# Altium schematic sheet Output.SchDoc
size A4
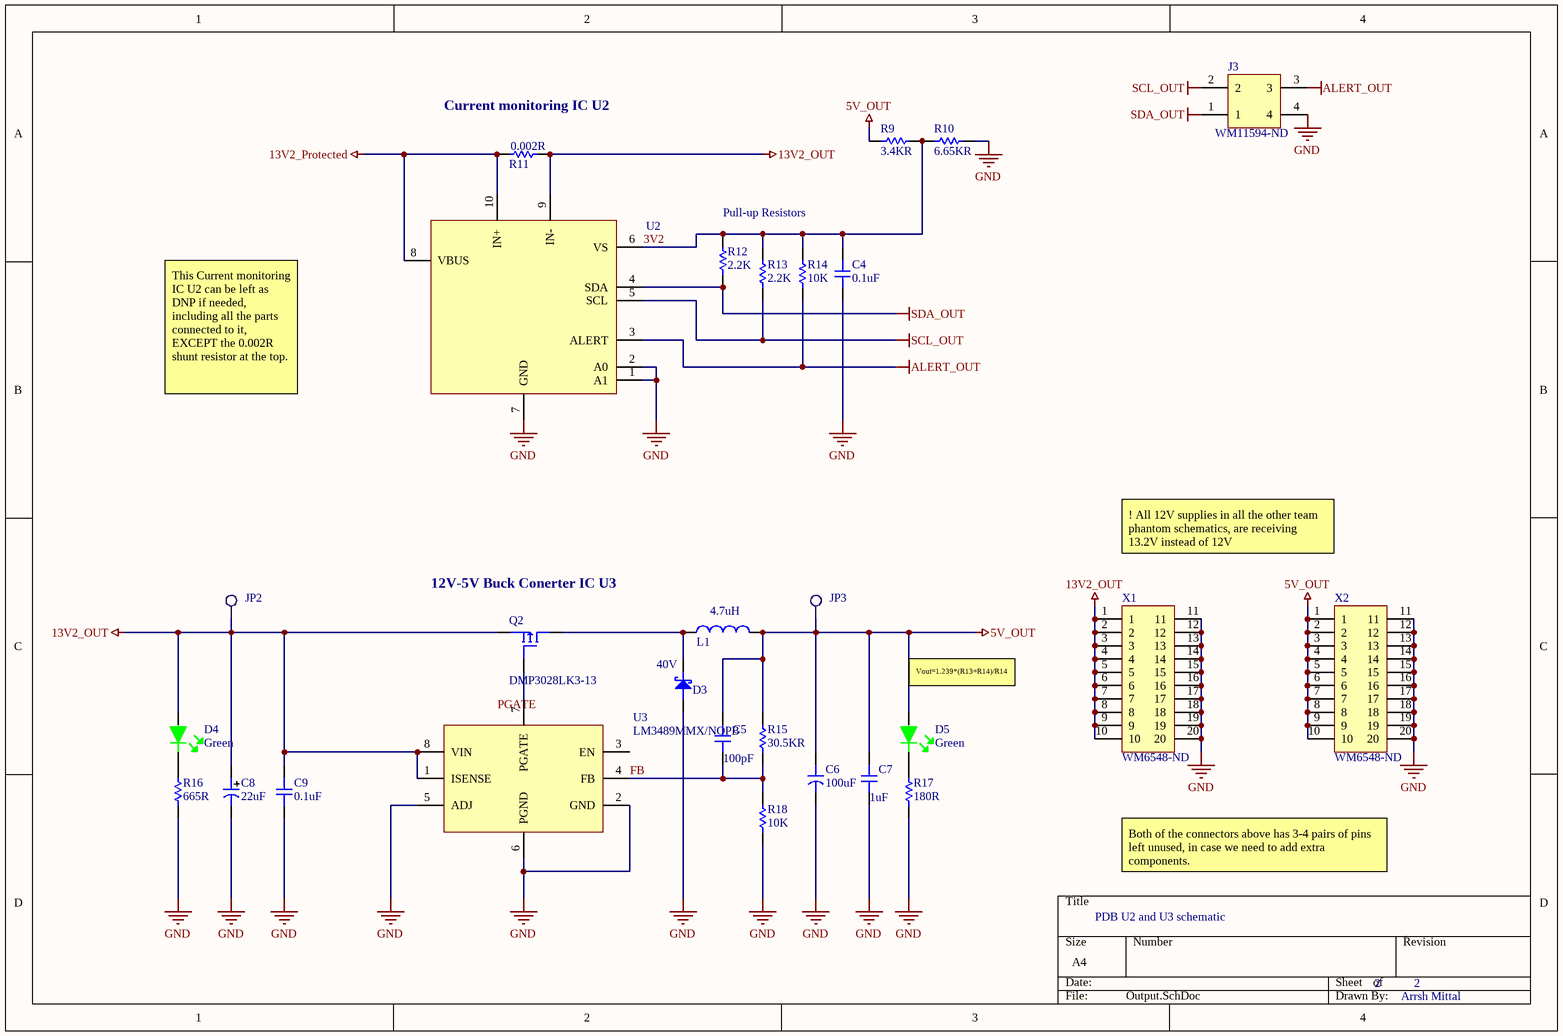
[diagram p0: Output.SchDoc]

## Parts
C4  0.1uF  [CAP-0805]
C5  100pF
C6  100uF  [CAP-1411]
C7  1uF  [CAP-0603]
C8  22uF
C9  0.1uF  [CAP-0805]
D3  40V
D4  Green  [LED-0603]
D5  Green  [LED-0603]
J3  WM11594-ND  [2X2PIN]
JP2  Testpoint2  [TP2]  (value not drawn)
JP3  Testpoint2  [TP2]  (value not drawn)
L1  4.7uH
Q2  DMP3028LK3-13  [DPAK228P990X239-4N]
R9  3.4KR  [RESC1608X50N]
R10  6.65KR  [RESC1608X50N]
R11  0.002R  [2512]
R12  2.2K  [RES-0603]
R13  2.2K  [RES-0603]
R14  10K  [RES-0603]
R15  30.5KR
R16  665R  [RES-0603]
R17  180R  [RES-0603]
R18  10K  [RES-0402]
U2  INA226AIDGSR  [SOP50P490X110-10N]  (value not drawn)
U3  LM3489MMX/NOPB  [SOP65P490X110-8N]
X1  WM6548-ND  [MOLEX_20pin(RECT)]
X2  WM6548-ND  [MOLEX_20pin(RECT)]

## Nets
5V_OUT: C5.2 C6.2 C7.2 D5.1 JP3.1 L1.2 R9.1 R15.2 X2.1 X2.2 X2.3 X2.4 X2.5 X2.6 X2.7 X2.8 X2.9 X2.10
13V2_OUT: C8.1 C9.2 D4.1 JP2.1 Q2.3 R11.1 U2.9(IN-) U3.1(ISENSE) U3.8(VIN) X1.1 X1.2 X1.3 X1.4 X1.5 X1.6 X1.7 X1.8 X1.9 X1.10
13V2_Protected: R11.2 U2.8(VBUS) U2.10(IN+)
ALERT_OUT: J3.3 R14.1 U2.3(ALERT)
GND: C4.1 C6.1 C7.1 C8.2 C9.1 D3.2 J3.4 R10.2 R16.1 R17.1 R18.1 U2.1(A1) U2.2(A0) U2.7(GND) U3.2(GND) U3.5(ADJ) U3.6(PGND) X1.11 X1.12 X1.13 X1.14 X1.15 X1.16 X1.17 X1.18 X1.19 X1.20 X2.11 X2.12 X2.13 X2.14 X2.15 X2.16 X2.17 X2.18 X2.19 X2.20
SCL_OUT: J3.2 R13.1 U2.5(SCL)
SDA_OUT: J3.1 R12.1 U2.4(SDA)
3V2: C4.2 R9.2 R10.1 R12.2 R13.2 R14.2 U2.6(VS)
FB: C5.1 R15.1 R18.2 U3.4(FB)
NetD3_1: D3.1 L1.1 Q2.2
NetD4_2: D4.2 R16.2
NetD5_2: D5.2 R17.2
NetQ2_1: Q2.1 U3.7(PGATE)

Not connected (* = marked no-connect by the designer): U3 3(EN)

## Notes on the sheet
- (near R11) Current monitoring IC U2
- Pull-up Resistors
- This Current monitoring IC U2 can be left as DNP if needed, including all the parts connected to it, EXCEPT the 0.002R shunt resistor at the top.
- ! All 12V supplies in all the other team phantom schematics, are receiving 13.2V instead of 12V
- (near Q2) 12V-5V Buck Conerter IC U3
- (near D5) Vout=1.239*(R13+R14)/R14
- PDB U2 and U3 schematic
- Both of the connectors above has 3-4 pairs of pins left unused, in case we need to add extra components.
- 2
- Arrsh Mittal

## Library data of the parts
C4 = 0805-0.1uF-16V: CAP CER 0.1UF 16V Y5V 0805; Manufacturer: KEMET; Manufacturer Part Number: C0805C104Z4VACTU; Dielectric Material: Ceramic; Capacitance: 100nF; Tolerance: 80%; Supplier 1: Digi-Key; Stock 1: 18565; Pricing 1: 1=0.11, 10=0.081, 100=0.038, 500=0.02664, 1000=0.02205 (USD); Mount: Surface Mount; Case/Package: 0805; Case Code (Metric): 2012; Case Code (Imperial): 0805; Min Operating Temperature: -30°C; Max Operating Temperature: 85°C; Package Quantity: 1; Voltage Rating: 16V; Packaging: Tape and Reel; Voltage Rating (DC): 16V; Dielectric: Y5V; Termination: SMD/SMT; Length: 2mm; Height: 0.78mm; Width: 0.049inch; Thickness: 0.035inch; Lead Pitch: 0.75mm; Depth: 1.25mm; Lead Free: Lead Free; ComponentLink1URL: https://search.kemet.com/component-edge/download/datasheet/C0805C104Z4VACTU.pdf?src-supplier=Digi-Key; ComponentLink1Description: https://search.kemet.com/component-edge/download/datasheet/C0805C104Z4VACTU.pdf?src-supplier=Digi-Key; ComponentLink2URL: https://api.kemet.com/component-edge/download/datasheet/C0805C104Z4VACTU.pdf?src-supplier=Digi-Key; ComponentLink2Description: https://api.kemet.com/component-edge/download/datasheet/C0805C104Z4VACTU.pdf?src-supplier=Digi-Key; ComponentLink3URL: http://www.mouser.com/ds/2/212/KEM_C1005_Y5V_SMD-1101305.pdf?src-supplier=Mouser; ComponentLink3Description: http://www.mouser.com/ds/2/212/KEM_C1005_Y5V_SMD-1101305.pdf?src-supplier=Mouser; ComponentLink4URL: http://components.arrow.com/part/dataview/2091119S8993596N7429?src-supplier=Arrow; ComponentLink4Description: http://components.arrow.com/part/dataview/2091119S8993596N7429?src-supplier=Arrow; Supplier Part Number 1: 399-9159-6-ND
C5 = 0603-100pF-50V: 0603 100 pF 50 V ±5% Tolerance C0G/NP0 SMT Multilayer Ceramic Capacitor; Manufacturer: Kyocera AVX; Manufacturer Part Number: 06035A101JAT2A\4K; Supplier 1: Digi-Key; Stock 1: 87306; Pricing 1: 1=0.1, 10=0.074, 50=0.0402, 100=0.0329, 500=0.02348, 1000=0.01845 (USD); Supplier Part Number 1: 478-1175-6-ND
C6 = 1411-100uF-6.3V: CAP TANT 100UF 10% 6.3V 1411; Manufacturer: KEMET; Manufacturer Part Number: T495B107K006ATE400; ESR (Equivalent Series Resistance): 400mR; Polarity: Polar; Life (Hours): 2000Hour; Dissipation Factor: 15%; Supplier 1: Digi-Key; Stock 1: 3565; Pricing 1: 1=1.82, 10=1.471, 100=1.123, 500=0.8556, 1000=0.74865 (USD); Mount: Surface Mount; Case/Package: 1411; Weight: 0.002293oz; Case Code (Metric): 3528; Case Code (Imperial): 1411; Min Operating Temperature: -55°C; Max Operating Temperature: 125°C; Package Quantity: 1; Capacitance: 100uF; Voltage Rating: 6.3V; Tolerance: 10%; Packaging: Tape and Reel; Voltage Rating (DC): 6.3V; Termination: SMD/SMT; Features: General Purpose; Length: 3.5mm; Height: 2.8mm; Width: 0.11inch; Height - Seated (Max): 0.083inch; Depth: 2.8mm; Radiation Hardening: No; REACH SVHC: No SVHC; ComponentLink1URL: https://search.kemet.com/component-edge/download/datasheet/T495B107K006ATE400.pdf?src-supplier=Digi-Key; ComponentLink1Description: https://search.kemet.com/component-edge/download/datasheet/T495B107K006ATE400.pdf?src-supplier=Digi-Key; ComponentLink2URL: http://www.farnell.com/datasheets/2015696.pdf?src-supplier=Element14; ComponentLink2Description: http://www.farnell.com/datasheets/2015696.pdf?src-supplier=Element14; ComponentLink3URL: http://www.farnell.com/datasheets/2015696.pdf?src-supplier=Farnell; ComponentLink3Description: http://www.farnell.com/datasheets/2015696.pdf?src-supplier=Farnell; ComponentLink4URL: http://components.arrow.com/part/dataview/43511620S9336597N7429?src-supplier=Arrow; ComponentLink4Description: http://components.arrow.com/part/dataview/43511620S9336597N7429?src-supplier=Arrow; ComponentLink5URL: http://components.arrow.com/part/dataview/0323_00067285?src-supplier=Arrow+Europe; ComponentLink5Description: http://components.arrow.com/part/dataview/0323_00067285?src-supplier=Arrow+Europe; ComponentLink6URL: http://www.mouser.com/ds/2/212/KEM_T2071_T495_COTS-1104607.pdf?src-supplier=Mouser; ComponentLink6Description: http://www.mouser.com/ds/2/212/KEM_T2071_T495_COTS-1104607.pdf?src-supplier=Mouser; ComponentLink7URL: http://www.kemet.com/Lists/ProductCatalog/Attachments/261/KEM_T2009_T495.pdf?src-supplier=Avnet; ComponentLink7Description: http://www.kemet.com/Lists/ProductCatalog/Attachments/261/KEM_T2009_T495.pdf?src-supplier=Avnet; Supplier Part Number 1: 399-10286-6-ND
C7 = 0603-1uF-16V: CAP CER 1UF 16V X7R 0603; Manufacturer: KEMET; Manufacturer Part Number: C0603C105K4RACTU; Dielectric Material: Ceramic; Tolerance: 10%; Dissipation Factor: 3.5%; Supplier 1: Digi-Key; Stock 1: 600463; Pricing 1: 1=0.12, 10=0.088, 100=0.0391, 500=0.02792, 1000=0.02193 (USD); Mount: Surface Mount,PCB; Case/Package: 0603; Number of Pins: 2; Case Code (Metric): 1608; Case Code (Imperial): 0603; Contact Plating: Tin,Matte; Min Operating Temperature: -55°C; Max Operating Temperature: 125°C; Package Quantity: 4000; Capacitance: 1uF; Voltage Rating: 16V; Packaging: Tape and Reel; Voltage Rating (DC): 16V; Dielectric: X7R; Termination: SMD/SMT; Voltage: 16V; Length: 1.6mm; Height: 0.8mm; Width: 0.031inch; Thickness: 0.034inch; Depth: 0.8mm; Radiation Hardening: No; REACH SVHC: No SVHC; ComponentLink1URL: http://www.mouser.com/ds/2/212/KEM_C1002_X7R_SMD-1102033.pdf?src-supplier=Mouser; ComponentLink1Description: http://www.mouser.com/ds/2/212/KEM_C1002_X7R_SMD-1102033.pdf?src-supplier=Mouser; ComponentLink2URL: http://www.kemet.com/kemet/web/homepage/kechome.nsf/file/Commercial%20Ceramic%20Chips%20X7R%20Dielectric/$file/KEM_C1002_X7R_SMD.pdf?src-supplier=Element14; ComponentLink2Description: http://www.kemet.com/kemet/web/homepage/kechome.nsf/file/Commercial%20Ceramic%20Chips%20X7R%20Dielectric/$file/KEM_C1002_X7R_SMD.pdf?src-supplier=Element14; ComponentLink3URL: https://www.verical.com/server-webapp/html/getDatasheet?partID=385479&src-supplier=Verical; ComponentLink3Description: https://www.verical.com/server-webapp/html/getDatasheet?partID=385479&src-supplier=Verical; ComponentLink4URL: http://www.kemet.com/kemet/web/homepage/kechome.nsf/vapubfiles/KEM_C1002_X7R_SMD.pdf/$file/KEM_C1002_X7R_SMD.pdf?src-supplier=Element14; ComponentLink4Description: http://www.kemet.com/kemet/web/homepage/kechome.nsf/vapubfiles/KEM_C1002_X7R_SMD.pdf/$file/KEM_C1002_X7R_SMD.pdf?src-supplier=Element14; Supplier Part Number 1: 399-7847-6-ND
C8 = AEC-22uF-50V: Aluminum Electrolytic Capacitors - SMD 22uF 50 Volts 20% LYTICS/IC; Manufacturer: CDE Illinois Capacitor; Manufacturer Part Number: 226SML050M; Voltage Rating: 50V; ESR (Equivalent Series Resistance): 9.043R; Polarity: Polar; Ripple Current: 71mA; Life (Hours): 2000Hour; Supplier 1: Digi-Key; Stock 1: 2681; Pricing 1: 1=0.36, 10=0.248, 50=0.1732, 100=0.1485, 500=0.11138 (USD); Mount: Surface Mount; Case/Package: Radial; Min Operating Temperature: -40°C; Max Operating Temperature: 85°C; Capacitance: 22uF; Package Quantity: 1000; Packaging: Tape and Reel; Tolerance: 20%; Voltage Rating (DC): 50V; Diameter: 6.3mm; Length: 5.8mm; Height - Seated (Max): 0.217inch; Lead Free: Lead Free; ComponentLink1URL: http://www.illinoiscapacitor.com/pdf/seriesDocuments/SML%20series.pdf?src-supplier=Future+Electronics; ComponentLink1Description: http://www.illinoiscapacitor.com/pdf/seriesDocuments/SML%20series.pdf?src-supplier=Future+Electronics; Supplier Part Number 1: 1572-1392-6-ND
C9 = 0805-0.1uF-50V: CAP CER 0.1UF 50V Y5V 0805; Manufacturer: KEMET; Manufacturer Part Number: C0805C104Z5VACTU; Dielectric Material: Ceramic; Capacitance: 100nF; Tolerance: 80%; Dissipation Factor: 5%; Supplier 1: Digi-Key; Stock 1: 929243; Pricing 1: 1=0.1, 10=0.057, 100=0.0254, 500=0.01818, 1000=0.01428 (USD); Mount: Surface Mount,PCB; Case/Package: 0805; Number of Pins: 2; Case Code (Metric): 2012; Case Code (Imperial): 0805; Min Operating Temperature: -30°C; Max Operating Temperature: 85°C; Package Quantity: 1; Voltage Rating: 50V; Packaging: Tape and Reel; Voltage Rating (DC): 50V; Dielectric: Y5V; Termination: SMD/SMT; Voltage: 50V; Length: 2mm; Height: 0.9mm; Lead Pitch: 0.75mm; Width: 0.049inch; Thickness: 0.039inch; Depth: 1.25mm; Radiation Hardening: No; REACH SVHC: No SVHC; Lead Free: Lead Free; ComponentLink1URL: http://www.alliedelec.com/m/d/9bfe7773041ffe9d406e68bc7b377fdd.pdf?src-supplier=Allied+Electronics; ComponentLink1Description: http://www.alliedelec.com/m/d/9bfe7773041ffe9d406e68bc7b377fdd.pdf?src-supplier=Allied+Electronics; ComponentLink2URL: https://www.verical.com/server-webapp/html/getDatasheet?partID=37101&src-supplier=Verical; ComponentLink2Description: https://www.verical.com/server-webapp/html/getDatasheet?partID=37101&src-supplier=Verical; ComponentLink3URL: https://www.verical.com/server-webapp/html/getDatasheet?partID=321176&src-supplier=Verical; ComponentLink3Description: https://www.verical.com/server-webapp/html/getDatasheet?partID=321176&src-supplier=Verical; ComponentLink4URL: http://www.farnell.com/datasheets/2123124.pdf?src-supplier=Element14; ComponentLink4Description: http://www.farnell.com/datasheets/2123124.pdf?src-supplier=Element14; Supplier Part Number 1: 399-1177-6-ND
D3 = Schottky-40V-8A: DIODE SCHOTTKY 40V 8A DO214AB; Manufacturer: MCC; Manufacturer Part Number: SK84L-TP; Forward Voltage: 650mV; Max Reverse Current: 20mA; Max Forward Surge Current (Ifsm): 200A; Supplier 1: Digi-Key; Stock 1: 7713; Pricing 1: 1=0.72, 10=0.62, 100=0.4293, 500=0.3587, 1000=0.30528 (USD); Mount: Surface Mount; Number of Pins: 2; Min Operating Temperature: -55°C; Max Operating Temperature: 150°C; Packaging: Tape and Reel; Package Quantity: 1; Average Rectified Current: 8A; Forward Current: 8A; Max Repetitive Reverse Voltage (Vrrm): 40V; Max Reverse Voltage (DC): 40V; Series: SK84L; Lead Free: Lead Free; RoHS Compliant: Yes; ComponentLink1URL: http://www.mccsemi.com/up_pdf/SK82L-SK810L(SMC).PDF?src-supplier=Future+Electronics; ComponentLink1Description: http://www.mccsemi.com/up_pdf/SK82L-SK810L(SMC).PDF?src-supplier=Future+Electronics; ComponentLink2URL: http://www.mccsemi.com/up_pdf/SK82L-SK810L(SMC).PDF?src-supplier=Digi-Key; ComponentLink2Description: http://www.mccsemi.com/up_pdf/SK82L-SK810L(SMC).PDF?src-supplier=Digi-Key; Supplier Part Number 1: SK84L-TPMSDKR-ND
D4 D5 = LED-Green: LED GREEN CLEAR 0603 SMD; Manufacturer: Wurth Electronics; Manufacturer Part Number: 150060VS75000; Luminous Intensity: 40mcd; Viewing Angle: 140°; Forward Voltage: 2V; Wavelength: 570nm; Lens Style: Clear,Rectangular; Forward Current: 30mA; Test Current: 20mA; Supplier 1: Digi-Key; Stock 1: 118118; Pricing 1: 1=0.14, 50=0.133, 100=0.114, 500=0.099 (USD); Mount: Surface Mount; Case/Package: 0603; Number of Pins: 2; Color: Green; Case Code (Metric): 1608; Case Code (Imperial): 0603; Min Operating Temperature: -40°C; Max Operating Temperature: 85°C; Package Quantity: 1; Packaging: Tape and Reel; Dominant Wavelength: 570nm; Length: 1.6mm; Height: 0.7mm; Width: 0.8mm; REACH SVHC: Unknown; ComponentLink1URL: https://katalog.we-online.de/led/datasheet/150060VS75000.pdf?src-supplier=Digi-Key; ComponentLink1Description: https://katalog.we-online.de/led/datasheet/150060VS75000.pdf?src-supplier=Digi-Key; Supplier Part Number 1: 732-4980-1-ND
J3 = 2X2PIN: CONN HEADER R/A 4POS 3.5MM; Manufacturer: Molex; Manufacturer Part Number: 172316-1104; Number of Positions: 4; Gender: Male; Connector Type: Male Pin; Pitch: 0.138inch; Row Spacing: 0.181inch; Supplier 1: Digi-Key; Stock 1: 4392; Pricing 1: 1=0.93, 10=0.814, 100=0.7027, 500=0.57492, 1000=0.51104, 5000=0.44716, 10000=0.4248 (USD); Mount: Through Hole; Number of Pins: 4; Contact Plating: Tin; Color: Black; Contact Material: Copper Alloy; Packaging: Tray; Number of Rows: 2; Termination: Solder; Fastening Type: Latch; Number of Circuits: 4; Number of Contacts: 4; REACH SVHC: Unknown; ComponentLink1URL: http://www.alliedelec.com/images/products/datasheets/bm/MOLEX/70617684.pdf?src-supplier=Allied+Electronics; ComponentLink1Description: http://www.alliedelec.com/images/products/datasheets/bm/MOLEX/70617684.pdf?src-supplier=Allied+Electronics; ComponentLink2URL: http://www.farnell.com/datasheets/1944206.pdf?src-supplier=Element14; ComponentLink2Description: http://www.farnell.com/datasheets/1944206.pdf?src-supplier=Element14; ComponentLink3URL: http://www.farnell.com/datasheets/2214524.pdf?src-supplier=Farnell; ComponentLink3Description: http://www.farnell.com/datasheets/2214524.pdf?src-supplier=Farnell; ComponentLink4URL: https://www.molex.com/pdm_docs/sd/1723161104_sd.pdf?src-supplier=Digi-Key; ComponentLink4Description: https://www.molex.com/pdm_docs/sd/1723161104_sd.pdf?src-supplier=Digi-Key; ComponentLink5URL: http://www.farnell.com/datasheets/1955765.pdf?src-supplier=Element14; ComponentLink5Description: http://www.farnell.com/datasheets/1955765.pdf?src-supplier=Element14; Supplier Part Number 1: WM11594-ND
JP2 JP3 = Testpoint2: Single layer pad TP
L1 = 4.7uH-10A: FIXED IND 4.7UH 10A 15.5 MOHM; Manufacturer: Pulse; Manufacturer Part Number: PA4342.472NLT; Saturation Current: 17A; Shielding: Shielded; DC Resistance (DCR): 15.5mR; Test Frequency: 100kHz; Tolerance: 20%; Supplier 1: Digi-Key; Stock 1: 7500; Pricing 1: 1=1.22, 10=1.138, 25=1.05, 50=0.875, 100=0.8225, 250=0.735 (USD); Mount: Surface Mount; Case/Package: Nonstandard; Min Operating Temperature: -40°C; Max Operating Temperature: 125°C; Packaging: Tape and Reel; Inductance: 4.7uH; Current Rating: 10A; Length: 0.453inch; Width: 0.406inch; Height - Seated (Max): 0.157inch; Ratings: AEC-Q200; RoHS Compliant: Yes; ComponentLink1URL: http://productfinder.pulseeng.com/products/datasheets/P769.pdf?src-supplier=Digi-Key; ComponentLink1Description: http://productfinder.pulseeng.com/products/datasheets/P769.pdf?src-supplier=Digi-Key; Supplier Part Number 1: 553-3001-6-ND
Q2 = P-FET-30V-27A: MOSFET P-CH 30V 27A TO252; Manufacturer: Diodes; Rds On Max: 25mR; Input Capacitance: 1.241nF; Max Power Dissipation: 1.6W; Supplier 1: Digi-Key; Manufacturer Part Number: DMP3028LK3-13; Stock 1: 3306; Pricing 1: 1=0.62, 10=0.536, 25=0.5116, 100=0.3712, 500=0.3102, 1000=0.264 (USD); Mount: Surface Mount; Case/Package: TO-252-3; Min Operating Temperature: -55°C; Max Operating Temperature: 150°C; Packaging: Tape and Reel; Drain to Source Voltage (Vdss): 30V; Continuous Drain Current (ID): 27A; RoHS Compliant: Yes; ComponentLink1URL: http://www.mouser.com/ds/2/115/DMP3028LK3-526241.pdf?src-supplier=Mouser; ComponentLink1Description: http://www.mouser.com/ds/2/115/DMP3028LK3-526241.pdf?src-supplier=Mouser; ComponentLink2URL: https://www.diodes.com/assets/Datasheets/DMP3028LK3.pdf?src-supplier=Digi-Key; ComponentLink2Description: https://www.diodes.com/assets/Datasheets/DMP3028LK3.pdf?src-supplier=Digi-Key; Supplier Part Number 1: DMP3028LK3-13DICT-ND
R9 = 0603-3.4KR: Res Thin Film 0603 3.4K Ohm 0.1% 1/10W ±25ppm/°C Molded SMD Paper T/R; Manufacturer: TE Connectivity; Manufacturer Part Number: RP73PF1J3K4BTDF; Power Rating: 166mW; Voltage Rating: 100V; Supplier 1: Digi-Key; Stock 1: 669; Pricing 1: 1=0.69, 10=0.494, 100=0.2568 (USD); Case/Package: 0603; Case Code (Metric): 1608; Case Code (Imperial): 0603; Min Operating Temperature: -55°C; Max Operating Temperature: 155°C; Resistance: 3.4kR; Tolerance: 0.1%; Termination: SMD/SMT; Packaging: Cut Tape; Resistor Type: Thin Film; Temperature Coefficient: 25ppm/°C; Voltage Rating (DC): 100V; Technology: THIN FILM; Series: RP73; Resistance Tolerance: 0.1%; Length: 1.55mm; Height: 0.45mm; Depth: 0.8mm; RoHS Compliant: Yes; REACH SVHC: No SVHC; ComponentLink1URL: http://www.farnell.com/datasheets/1635325.pdf?src-supplier=Element14; ComponentLink1Description: http://www.farnell.com/datasheets/1635325.pdf?src-supplier=Element14; Supplier Part Number 1: A110159DKR-ND
R10 = 0603-6.65KR: RES SMD 6.65K OHM 0.1% 1/6W 0603; Manufacturer: TE Connectivity; Manufacturer Part Number: 8-2176088-4; Power Rating: 166mW; Temperature Coefficient: 25ppm/°C; Voltage Rating: 100V; Max Power Dissipation: 167mW; Supplier 1: Digi-Key; Stock 1: 400; Pricing 1: 1=0.69, 10=0.494, 100=0.2568 (USD); Mount: Surface Mount; Case/Package: 0603; Case Code (Metric): 1608; Case Code (Imperial): 0603; Min Operating Temperature: -55°C; Max Operating Temperature: 155°C; Packaging: Tape and Reel; Resistance: 6.65kR; Tolerance: 0.1%; Resistor Type: Thin Film; Termination: Solder; Package Quantity: 1000; Number of Terminations: 2; Length: 0.061inch; Width: 0.031inch; Height: 0.022inch; ComponentLink1URL: http://www.te.com/commerce/DocumentDelivery/DDEController?Action=srchrtrv&DocNm=1773272&DocType=DS&DocLang=English&src-supplier=Digi-Key; ComponentLink1Description: http://www.te.com/commerce/DocumentDelivery/DDEController?Action=srchrtrv&DocNm=1773272&DocType=DS&DocLang=English&src-supplier=Digi-Key; Supplier Part Number 1: A110187DKR-ND
R11 = 2512-0.002R-5W: BOURNS - CSS2H-2512K-2L00F - SMD Current Sense Resistor, 0.002 ohm, CSS2H-2512 Series, 2512 [6432 Metric], 5 W, ± 1%; Resistance: 2mR; Power Rating: 5W; Temperature Coefficient: 50ppm/°C; Supplier 1: Digi-Key; Manufacturer: Bourns; Manufacturer Part Number: CSS2H-2512K-2L00F; Stock 1: 1384; Pricing 1: 1=0.88, 10=0.775, 25=0.7124, 50=0.65, 100=0.5625, 250=0.475, 500=0.4, 1000=0.3325 (USD); Case/Package: 2512; Case Code (Metric): 6432; Case Code (Imperial): 2512; Min Operating Temperature: -55°C; Max Operating Temperature: 170°C; Packaging: Cut Tape; Resistor Type: Metal Element,Metal Strip; Number of Terminations: 2; Tolerance: 1%; Max Power Dissipation: 5W; Features: Moisture Resistant; Length: 0.25inch; Width: 0.12inch; Height: 0.02inch; REACH SVHC: No SVHC; RoHS Compliant: Yes; ComponentLink1URL: http://www.farnell.com/datasheets/2058210.pdf?src-supplier=Farnell; ComponentLink1Description: http://www.farnell.com/datasheets/2058210.pdf?src-supplier=Farnell; ComponentLink2URL: http://www.farnell.com/datasheets/2058210.pdf?src-supplier=Element14; ComponentLink2Description: http://www.farnell.com/datasheets/2058210.pdf?src-supplier=Element14; ComponentLink3URL: http://www.mouser.com/ds/2/54/ss2h-2512-935127.pdf?src-supplier=Mouser; ComponentLink3Description: http://www.mouser.com/ds/2/54/ss2h-2512-935127.pdf?src-supplier=Mouser; ComponentLink4URL: http://www.farnell.com/datasheets/2058210.pdf?src-supplier=Newark; ComponentLink4Description: http://www.farnell.com/datasheets/2058210.pdf?src-supplier=Newark; ComponentLink5URL: https://www.bourns.com/docs/Product-Datasheets/css2h-2512.pdf?src-supplier=Digi-Key; ComponentLink5Description: https://www.bourns.com/docs/Product-Datasheets/css2h-2512.pdf?src-supplier=Digi-Key; ComponentLink6URL: http://www.bourns.com/docs/Product-Datasheets/css2h-2512.pdf?src-supplier=Digi-Key; ComponentLink6Description: http://www.bourns.com/docs/Product-Datasheets/css2h-2512.pdf?src-supplier=Digi-Key; Supplier Part Number 1: CSS2H-2512K-2L00FDKR-ND
R12 R13 = 0603-2.2KR: RES SMD 2.2K OHM 1% 1/10W 0603; Manufacturer: Yageo Phycomp; Manufacturer Part Number: RC0603FR-072K2L; Power Rating: 100mW; Temperature Coefficient: 100ppm/°C; Resistance: 2.2kR; Voltage Rating (DC): 50V; Supplier 1: Digi-Key; Stock 1: 8205077; Pricing 1: 1=0.1, 10=0.023, 100=0.0094, 1000=0.00421, 2500=0.00366 (USD); Mount: Surface Mount; Case/Package: 0603; Number of Pins: 2; Min Operating Temperature: -55°C; Max Operating Temperature: 155°C; Tolerance: 1%; Packaging: Cut Tape; Length: 1.6mm; Height: 0.45mm; Depth: 0.8mm; Width: 800um; REACH SVHC: No SVHC; Lead Free: Lead Free; Supplier Part Number 1: 311-2.20KHRDKR-ND
R14 = 0603-10KR: RES SMD 10K OHM 5% 1/10W 0603; Manufacturer: Yageo; Manufacturer Part Number: RC0603JR-0710KL; Resistance: 10kR; Voltage Rating (DC): 50V; Temperature Coefficient: 100ppm/°C; Power Rating: 100mW; Supplier 1: Digi-Key; Stock 1: 3006558; Pricing 1: 1=0.1, 10=0.019, 100=0.0077, 1000=0.00347, 2500=0.00301 (USD); Case/Package: 0603; Number of Pins: 2; Contact Plating: Tin,Matte; Case Code (Imperial): 0603; Case Code (Metric): 1608; Min Operating Temperature: -55°C; Max Operating Temperature: 155°C; Packaging: Tape and Reel; Tolerance: 5%; Composition: Thick Film; Voltage Rating: 50V; Termination: SMD/SMT; Military Standard: Not; Features: Moisture Resistant; Max Power Dissipation: 100mW; Number of Terminations: 2; Length: 0.063inch; Width: 0.031inch; Depth: 0.8mm; Height - Seated (Max): 0.022inch; Radiation Hardening: No; REACH SVHC: Unknown; Lead Free: Lead Free; ComponentLink1URL: http://www.yageo.com/documents/recent/PYu-RC_Group_51_RoHS_L_10.pdf?src-supplier=Digi-Key; ComponentLink1Description: http://www.yageo.com/documents/recent/PYu-RC_Group_51_RoHS_L_10.pdf?src-supplier=Digi-Key; Supplier Part Number 1: 311-10KGRDKR-ND
R15 = 0402-30.5KR: RES 30.5K OHM 1% 1/16W 0402; Manufacturer: KOA Speer; Manufacturer Part Number: RN73R1ETTP3052F25; Supplier 1: Digi-Key; Stock 1: 9795; Pricing 1: 1=0.47, 10=0.336, 100=0.1346, 1000=0.0663, 2500=0.06142, 5000=0.05558 (USD); Supplier Part Number 1: 2019-RN73R1ETTP3052F25CT-ND
R16 = 0603-665R: RES SMD 665 OHM 1% 1/10W 0603; Manufacturer: Yageo; Manufacturer Part Number: RC0603FR-07665RL; Power Rating: 100mW; Voltage Rating: 75V; Temperature Coefficient: 100ppm/°C; Voltage Rating (DC): 50V; Supplier 1: Digi-Key; Stock 1: 143871; Pricing 1: 1=0.1, 10=0.023, 100=0.0094, 1000=0.00421, 2500=0.00366 (USD); Case/Package: 0603; Weight: 7.1E-05oz; Case Code (Imperial): 0603; Case Code (Metric): 1608; Contact Plating: Tin,Matte; Min Operating Temperature: -55°C; Max Operating Temperature: 155°C; Resistance: 665R; Tolerance: 1%; Packaging: Tape and Reel; Termination: SMD/SMT; Composition: Thick Film; Military Standard: Not; Package Quantity: 1; Number of Terminations: 2; Max Power Dissipation: 100mW; Features: Moisture Resistant; Length: 1.6mm; Height: 0.022inch; Width: 0.8mm; Depth: 0.8mm; Lead Free: Lead Free; ComponentLink1URL: http://www.yageo.com/documents/recent/PYu-RC_Group_51_RoHS_L_9.pdf?src-supplier=Digi-Key; ComponentLink1Description: http://www.yageo.com/documents/recent/PYu-RC_Group_51_RoHS_L_9.pdf?src-supplier=Digi-Key; ComponentLink2URL: http://www.yageo.com/documents/recent/PYu-RC0603_51_RoHS_L_4.pdf?src-supplier=Avnet; ComponentLink2Description: http://www.yageo.com/documents/recent/PYu-RC0603_51_RoHS_L_4.pdf?src-supplier=Avnet; ComponentLink3URL: http://www.yageo.com/documents/recent/PYu-RC_Group_51_RoHS_L_10.pdf?src-supplier=Digi-Key; ComponentLink3Description: http://www.yageo.com/documents/recent/PYu-RC_Group_51_RoHS_L_10.pdf?src-supplier=Digi-Key; ComponentLink4URL: http://www.yageo.com/documents/recent/PYu-RC0603_51_RoHS_L_4.pdf?src-supplier=Avnet+Europe; ComponentLink4Description: http://www.yageo.com/documents/recent/PYu-RC0603_51_RoHS_L_4.pdf?src-supplier=Avnet+Europe; Supplier Part Number 1: 311-665HRDKR-ND
R17 = 0603-180R: RES SMD 180 OHM 1% 1/10W 0603; Manufacturer: TE Connectivity; Manufacturer Part Number: CRGCQ0603F180R; Max Power Dissipation: 100mW; Temperature Coefficient: 100ppm/°C; Supplier 1: Digi-Key; Stock 1: 17329; Pricing 1: 1=0.1, 10=0.03, 100=0.012, 1000=0.00541, 2500=0.00469 (USD); Case/Package: 0603; Case Code (Imperial): 0603; Case Code (Metric): 1608; Min Operating Temperature: -55°C; Max Operating Temperature: 155°C; Composition: Thick Film; Features: Moisture Resistant,Automotive AEC-Q200; Packaging: Tape and Reel; Resistance: 180R; Tolerance: 1%; Number of Terminations: 2; ComponentLink1URL: https://www.te.com/commerce/DocumentDelivery/DDEController?Action=srchrtrv&DocNm=1773204-3&DocType=DS&DocLang=English&src-supplier=Digi-Key; ComponentLink1Description: https://www.te.com/commerce/DocumentDelivery/DDEController?Action=srchrtrv&DocNm=1773204-3&DocType=DS&DocLang=English&src-supplier=Digi-Key; ComponentLink2URL: https://www.te.com/commerce/DocumentDelivery/DDEController?Action=srchrtrv&amp;DocNm=1773204-3&amp;DocType=DS&amp;DocLang=English&src-supplier=Digi-Key; ComponentLink2Description: https://www.te.com/commerce/DocumentDelivery/DDEController?Action=srchrtrv&amp;DocNm=1773204-3&amp;DocType=DS&amp;DocLang=English&src-supplier=Digi-Key; ComponentLink3URL: http://www.te.com/commerce/DocumentDelivery/DDEController?Action=srchrtrv&DocNm=1773204-3&DocType=DS&DocLang=English&src-supplier=Digi-Key; ComponentLink3Description: http://www.te.com/commerce/DocumentDelivery/DDEController?Action=srchrtrv&DocNm=1773204-3&DocType=DS&DocLang=English&src-supplier=Digi-Key; ComponentLink4URL: http://www.farnell.com/datasheets/2609223.pdf?src-supplier=Farnell; ComponentLink4Description: http://www.farnell.com/datasheets/2609223.pdf?src-supplier=Farnell; Supplier Part Number 1: A129679DKR-ND
R18 = 0402-10KR: RES 10K OHM 1% 1/10W 0402; Manufacturer: KOA Speer; Manufacturer Part Number: RK73H1ETTP1002F; Resistance: 10kR; Power Rating: 63mW; Voltage Rating: 50V; Temperature Coefficient: 100ppm/°C; Supplier 1: Digi-Key; Stock 1: 8271315; Pricing 1: 1=0.1, 10=0.024, 100=0.0097, 1000=0.00437, 2500=0.0038, 5000=0.00314 (USD); Mount: Surface Mount; Case/Package: 0402; Case Code (Imperial): 0402; Case Code (Metric): 1005; Min Operating Temperature: -55°C; Max Operating Temperature: 155°C; Package Quantity: 10000; Packaging: Tape and Reel; Tolerance: 1%; Composition: Thick Film; Termination: SMD/SMT; Military Standard: Not; Voltage Rating (DC): 50V; Length: 1mm; Height: 0.35mm; Width: 0.5mm; Depth: 0.5mm; Lead Free: Lead Free; ComponentLink1URL: https://www.verical.com/server-webapp/html/getDatasheet?partID=117055&src-supplier=Verical; ComponentLink1Description: https://www.verical.com/server-webapp/html/getDatasheet?partID=117055&src-supplier=Verical; Supplier Part Number 1: 2019-RK73H1ETTP1002FDKR-ND
U2 = INA226AIDGSR: Bi Directional Current and Power Monitor 10-Pin VSSOP T/R; Manufacturer: Texas Instruments; Min Supply Voltage: 2.7V; Max Supply Voltage: 5.5V; Nominal Supply Current: 330uA; Common Mode Rejection Ratio: 140dB; Output Current: 10mA; Input Bias Current: 10uA; Input Offset Voltage (Vos): 2.5uV; Accuracy: 0.02%; Number of Amplifiers: 1; Bandwidth: 3.5kHz; Supplier 1: Digi-Key; Manufacturer Part Number: INA226AIDGSR; Stock 1: 55797; Pricing 1: 1=3.37, 10=3.027, 25=2.862, 100=2.3532, 250=2.11152, 500=2.0352, 1000=1.69176 (USD); Mount: Surface Mount; Case/Package: VSSOP; Number of Pins: 10; Contact Plating: Gold; Min Operating Temperature: -40°C; Max Operating Temperature: 125°C; Packaging: Tape and Reel; Package Quantity: 1; Series: -; Supply Current: 330uA; Radiation Hardening: No; REACH SVHC: No SVHC; Lead Free: Lead Free; RoHS Compliant: Yes; ComponentLink1URL: http://www.farnell.com/datasheets/1840205.pdf?src-supplier=Element14; ComponentLink1Description: http://www.farnell.com/datasheets/1840205.pdf?src-supplier=Element14; ComponentLink2URL: http://www.ti.com/lit/ds/symlink/ina226.pdf?src-supplier=Digi-Key; ComponentLink2Description: http://www.ti.com/lit/ds/symlink/ina226.pdf?src-supplier=Digi-Key; ComponentLink3URL: http://www.ti.com/lit/gpn/ina226?src-supplier=Mouser; ComponentLink3Description: http://www.ti.com/lit/gpn/ina226?src-supplier=Mouser; ComponentLink4URL: http://www.ti.com/general/docs/lit/getliterature.tsp?genericPartNumber=INA226&&fileType=pdf&src-supplier=Avnet; ComponentLink4Description: http://www.ti.com/general/docs/lit/getliterature.tsp?genericPartNumber=INA226&&fileType=pdf&src-supplier=Avnet; Supplier Part Number 1: 296-29034-1-ND
U3 = LM3489MMX/NOPB: DC DC Cntrlr Single-OUT Buck 4.5V to 35V Input 8-Pin VSSOP T/R; Manufacturer: TI National Semiconductor; Output Current: 4A; Number of Outputs: 1; Max Frequency: 1MHz; Duty Cycle: 100%; Switching Frequency: 1.4MHz; Quiescent Current: 280uA; Supplier 1: Digi-Key; Manufacturer Part Number: LM3489MMX/NOPB; Stock 1: 11594; Pricing 1: 1=1.66, 10=1.485, 25=1.4096, 100=1.0825, 250=0.95664, 500=0.9063, 1000=0.7049 (USD); Mount: Surface Mount; Case/Package: VSSOP; Number of Pins: 8; Contact Plating: Tin; Min Operating Temperature: -40°C; Max Operating Temperature: 125°C; Output Voltage: 35V; Packaging: Tape and Reel; Max Duty Cycle: 100%; Number of Channels: 1; Operating Supply Voltage: 35V; Radiation Hardening: No; Lead Free: Lead Free; RoHS Compliant: Yes; ComponentLink1URL: http://www.ti.com/lit/ds/symlink/lm3489.pdf?src-supplier=Digi-Key; ComponentLink1Description: http://www.ti.com/lit/ds/symlink/lm3489.pdf?src-supplier=Digi-Key; Supplier Part Number 1: 296-35277-6-ND
X1 X2 = RECT_MOLEX_20pin: Connector Header Through Hole 20 position 0.100" (2.54mm); Supplier 1: Digi-Key; ComponentLink1Description: https://www.digikey.ca/en/products/detail/0702462001/WM6548-ND/760170?utm_campaign=buynow&utm_medium=aggregator&curr=cad&utm_source=octopart; ComponentLink1URL: https://www.digikey.ca/en/products/detail/0702462001/WM6548-ND/760170?utm_campaign=buynow&utm_medium=aggregator&curr=cad&utm_source=octopart; Supplier Part Number 1: WM6548-ND